# Altium project 17-0003-01 SAGE BME280.PrjPcb
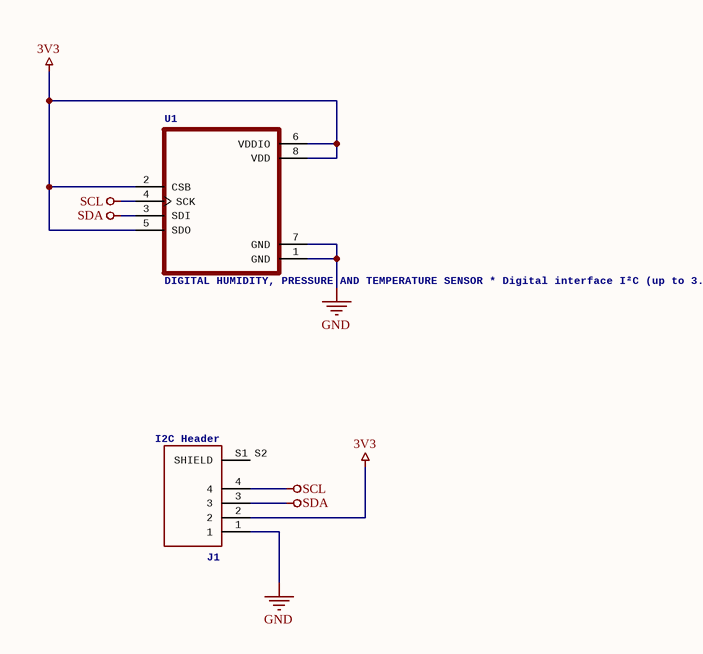
[diagram p0: Sheet1.SchDoc]
1 sheet, 2 parts. Net scope: global (net labels, ports and power ports of the same name join across sheets).

## Sheet Sheet1.SchDoc
size A

### Parts
J1  I2C Header  [CONN_BM04B-SRSS-TB(LF)(SN)]
U1  DIGITAL HUMIDITY, PRESSURE AND TEMPERATURE SENSOR * Digital interface I²C (up to 3.4 MHz) and SPI (3 and 4 wire, up to 10 MHz)* Supply voltage VDD main supply voltage range: 1.71 V to 3.6 V*VDDIO interface voltage range: 1.2 V to 3.6 V Operating range -40…+85 °C, 0…100 % rel. humidity, 300…1100 hPa   The library has been designed by Richard Magdycz Check availability  [PSON65P250X250X100-8N]

### Nets
3V3: J1.2 U1.2(CSB) U1.5(SDO) U1.6(VDDIO) U1.8(VDD)
GND: J1.1 U1.1(GND) U1.7(GND)
SCL: J1.4 U1.4(SCK)
SDA: J1.3 U1.3(SDI)

Not connected (* = marked no-connect by the designer): J1 S1 S2(SHIELD)

### Library data of the parts
J1 = BM04B-SRSS-TB(LF)(SN): GateName_1: G$1; MF: JST Sales; SymbolName_1: BM04B-SRSS-TB(LF)(SN); LibraryName: BM04B-SRSS-TB_LF__SN; DeviceSetName: BM04B-SRSS-TB(LF)(SN); Package: None; MP: BM04B-SRSS-TB(LF)(SN); DigiKey-Purchase-URL: https://snapeda.com/shop?store=DigiKey&id=91778; Digi-Key_Part_Number: 455-1790-1-ND
U1 = BME280: GateName_1: G$1; MF: Bosch; SymbolName_1: BME280; LibraryName: BME280; DeviceSetName: BME280; MP: BME280; Purchase-URL: https://pricing.snapeda.com/search/part/BME280/?ref=eda; Price: None; Package: LGA-8 Bosch; Availability: In Stock